# Altium schematic sheet Sheet1.SchDoc
size A4; SheetNumber: 2; SheetTotal: 3
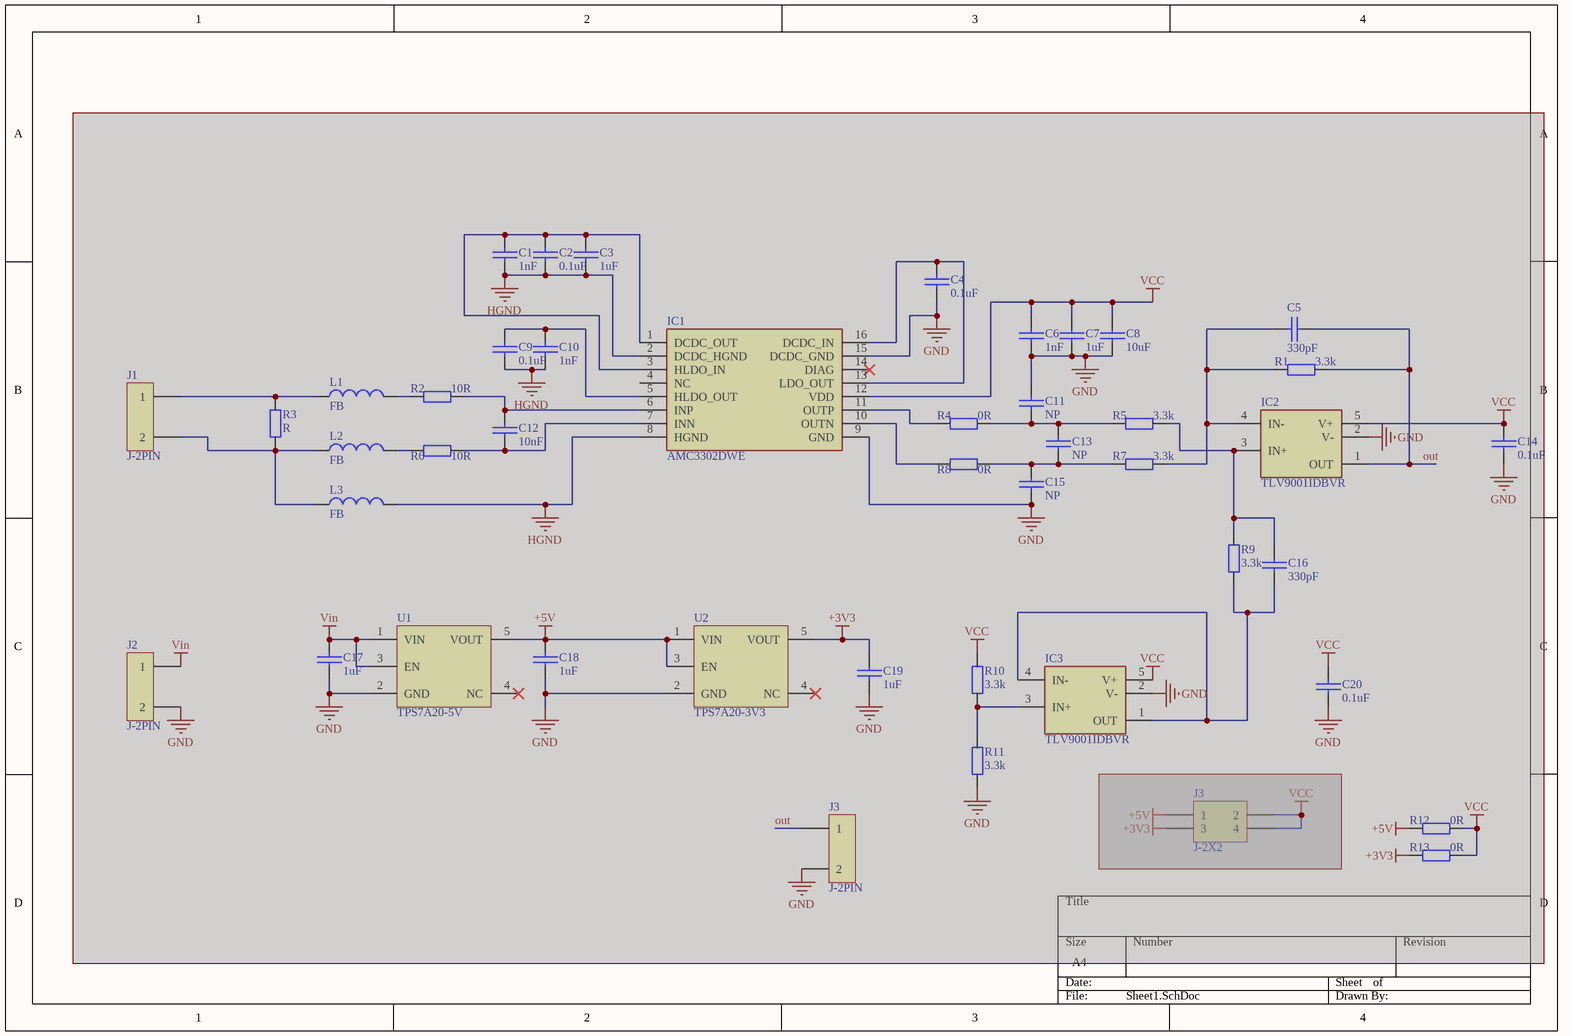
[diagram p0: Sheet1.SchDoc]

## Parts
(Parts that share a designator on the sheet are numbered #1, #2 ... from top to bottom, then left to right.)
C1  1nF  [C-0603]  (masked out: inside a compile mask, not in the netlist)
C2  0.1uF  [C-0603]  (masked out: inside a compile mask, not in the netlist)
C3  1uF  [C-0603]  (masked out: inside a compile mask, not in the netlist)
C4  0.1uF  [C-0603]  (masked out: inside a compile mask, not in the netlist)
C5  330pF  [C-0603]  (masked out: inside a compile mask, not in the netlist)
C6  1nF  [C-0603]  (masked out: inside a compile mask, not in the netlist)
C7  1uF  [C-0603]  (masked out: inside a compile mask, not in the netlist)
C8  10uF  [C-0603]  (masked out: inside a compile mask, not in the netlist)
C9  0.1uF  [C-0603]  (masked out: inside a compile mask, not in the netlist)
C10  1nF  [C-0603]  (masked out: inside a compile mask, not in the netlist)
C11  NP  [C-0603]  (masked out: inside a compile mask, not in the netlist)
C12  10nF  [C-0603]  (masked out: inside a compile mask, not in the netlist)
C13  NP  [C-0603]  (masked out: inside a compile mask, not in the netlist)
C14  0.1uF  [C-0603]  (masked out: inside a compile mask, not in the netlist)
C15  NP  [C-0603]  (masked out: inside a compile mask, not in the netlist)
C16  330pF  [C-0603]  (masked out: inside a compile mask, not in the netlist)
C17  1uF  [C-0603]  (masked out: inside a compile mask, not in the netlist)
C18  1uF  [C-0603]  (masked out: inside a compile mask, not in the netlist)
C19  1uF  [C-0603]  (masked out: inside a compile mask, not in the netlist)
C20  0.1uF  [C-0603]  (masked out: inside a compile mask, not in the netlist)
IC1  AMC3302DWE  [SOIC127P1030X265-16N]  (masked out: inside a compile mask, not in the netlist)
IC2  TLV9001IDBVR  [SOT95P280X145-5N]  (masked out: inside a compile mask, not in the netlist)
IC3  TLV9001IDBVR  [SOT95P280X145-5N]  (masked out: inside a compile mask, not in the netlist)
J1  J-2PIN  [CON  7.62mm 2x1P]  (masked out: inside a compile mask, not in the netlist)
J2  J-2PIN  [J-VH3.96-2A]  (masked out: inside a compile mask, not in the netlist)
J3#1  J-2X2  [PCBComponent_1]  (masked out: inside a compile mask, not in the netlist)
J3#2  J-2PIN  [SMA RF同轴链接器]  (masked out: inside a compile mask, not in the netlist)
L1  FB  [L-0402]  (masked out: inside a compile mask, not in the netlist)
L2  FB  [L-0402]  (masked out: inside a compile mask, not in the netlist)
L3  FB  [L-0402]  (masked out: inside a compile mask, not in the netlist)
R1  3.3k  [R-0603]  (masked out: inside a compile mask, not in the netlist)
R2  10R  [R-0603]  (masked out: inside a compile mask, not in the netlist)
R3  R  [R-2512]  (masked out: inside a compile mask, not in the netlist)
R4  0R  [R-0603]  (masked out: inside a compile mask, not in the netlist)
R5  3.3k  [R-0603]  (masked out: inside a compile mask, not in the netlist)
R6  10R  [R-0603]  (masked out: inside a compile mask, not in the netlist)
R7  3.3k  [R-0603]  (masked out: inside a compile mask, not in the netlist)
R8  0R  [R-0603]  (masked out: inside a compile mask, not in the netlist)
R9  3.3k  [R-0603]  (masked out: inside a compile mask, not in the netlist)
R10  3.3k  [R-0603]  (masked out: inside a compile mask, not in the netlist)
R11  3.3k  [R-0603]  (masked out: inside a compile mask, not in the netlist)
R12  0R  [R-0603]  (masked out: inside a compile mask, not in the netlist)
R13  0R  [R-0603]  (masked out: inside a compile mask, not in the netlist)
U1  TPS7A20-5V  [SOT-235]  (masked out: inside a compile mask, not in the netlist)
U2  TPS7A20-3V3  [SOT-235]  (masked out: inside a compile mask, not in the netlist)

## Library data of the parts
C1-C20 = C: Non Polarised
IC1 = AMC3302DWE: Integrated Circuit; Manufacturer_Name: Texas Instruments; Datasheet Link: https://www.ti.com/lit/ds/symlink/amc3302.pdf?ts=1643366130509; Height: 2.65mm; Manufacturer_Part_Number: AMC3302DWE; Mouser Part Number: 595-AMC3302DWE; Mouser Price/Stock: https://www.mouser.co.uk/ProductDetail/Texas-Instruments/AMC3302DWE?qs=DRkmTr78QAT3OfY8Rd%252BeWA%3D%3D; Arrow Part Number: AMC3302DWE; Arrow Price/Stock: https://www.arrow.com/en/products/amc3302dwe/texas-instruments?region=nac
IC2 IC3 = TLV9001IDBVR: Integrated Circuit; Manufacturer_Name: Texas Instruments; Datasheet Link: http://www.ti.com/lit/gpn/tlv9001; Height: 1.45mm; Manufacturer_Part_Number: TLV9001IDBVR; Mouser Part Number: 595-TLV9001IDBVR; Mouser Price/Stock: https://www.mouser.co.uk/ProductDetail/Texas-Instruments/TLV9001IDBVR?qs=gTYE2QTfZfR6dUkET6Yj7w%3D%3D; Arrow Part Number: TLV9001IDBVR; Arrow Price/Stock: https://www.arrow.com/en/products/tlv9001idbvr/texas-instruments?region=europe
L1-L3 = L-SMD: 1.8k@100Mhz
R1-R13 = R: Resistor
U1 U2 = TPS7A20-3V3: LDO  最大输出300mA
J3#1 = J-2X2: LatestRevisionDate: 17-Jul-2002; LatestRevisionNote: Re-released for DXP Platform.; Publisher: Altium Limited